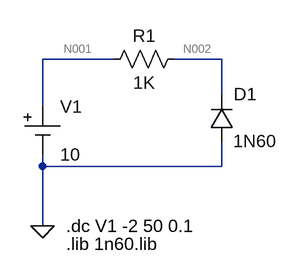
[diagram p0: schematic simulacionDiodo1N60Inversa.asc]
simulacionDiodo1N60Inversa.asc, the LTspice schematic file:
Version 4.1
SHEET 1 1644 680
WIRE 304 80 208 80
WIRE 448 80 384 80
WIRE 448 128 448 80
WIRE 208 144 208 80
WIRE 208 224 208 208
WIRE 448 224 448 192
WIRE 448 224 208 224
WIRE 208 304 208 224
FLAG 208 304 0
SYMBOL Misc\\cell 208 144 R0
WINDOW 123 0 0 Left 0
WINDOW 39 0 0 Left 0
SYMATTR InstName V1
SYMATTR Value 10
SYMBOL res 400 64 R90
WINDOW 0 0 56 VBottom 2
WINDOW 3 32 56 VTop 2
SYMATTR InstName R1
SYMATTR Value 1K
SYMBOL diode 464 192 R180
WINDOW 0 -31 65 Left 2
WINDOW 3 -57 2 Left 2
SYMATTR InstName D1
SYMATTR Value 1N60
TEXT 240 304 Left 2 !.dc V1 -2 50 0.1
TEXT 240 328 Left 2 !.lib 1n60.lib

The netlist it stands for:
* simulacionDiodo1N60Inversa.asc
V1 N001 0 10
R1 N002 N001 1K
D1 0 N002 1N60
.model D D
.lib standard.dio
.dc V1 -2 50 0.1
.lib 1n60.lib
.backanno
.end

* Results of the author's LTspice run, read from the files saved beside the schematic
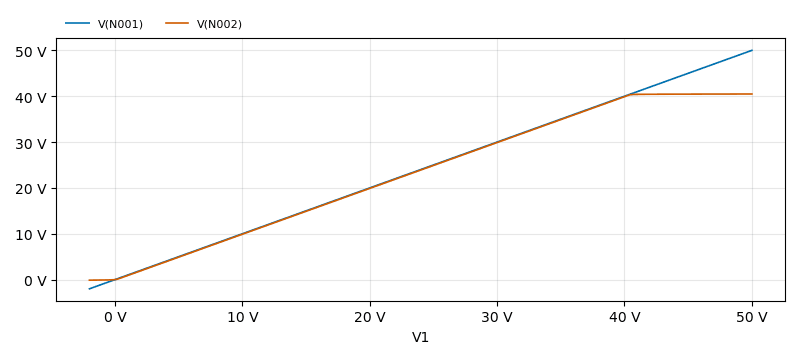
[diagram p1: DC transfer characteristic of simulacionDiodo1N60Inversa.asc, plotted from the saved traces]
* DC transfer characteristic, 1 run:
*   V(N001): -2 V at V1=-2 V, 50 V at V1=50 V, min -2 V, max 50 V
*   V(N002): -117.8 mV at V1=-2 V, 40.48 V at V1=50 V, min -117.8 mV, max 40.48 V